# Altium schematic sheet Inputs.SchDoc: Controlo do Movimento de uma Claraboia
size A4; Author: André Moreira Oliveira; DocumentNumber: 1; Revision: 0.1; SheetNumber: 1; SheetTotal: 5; Number: 1181045
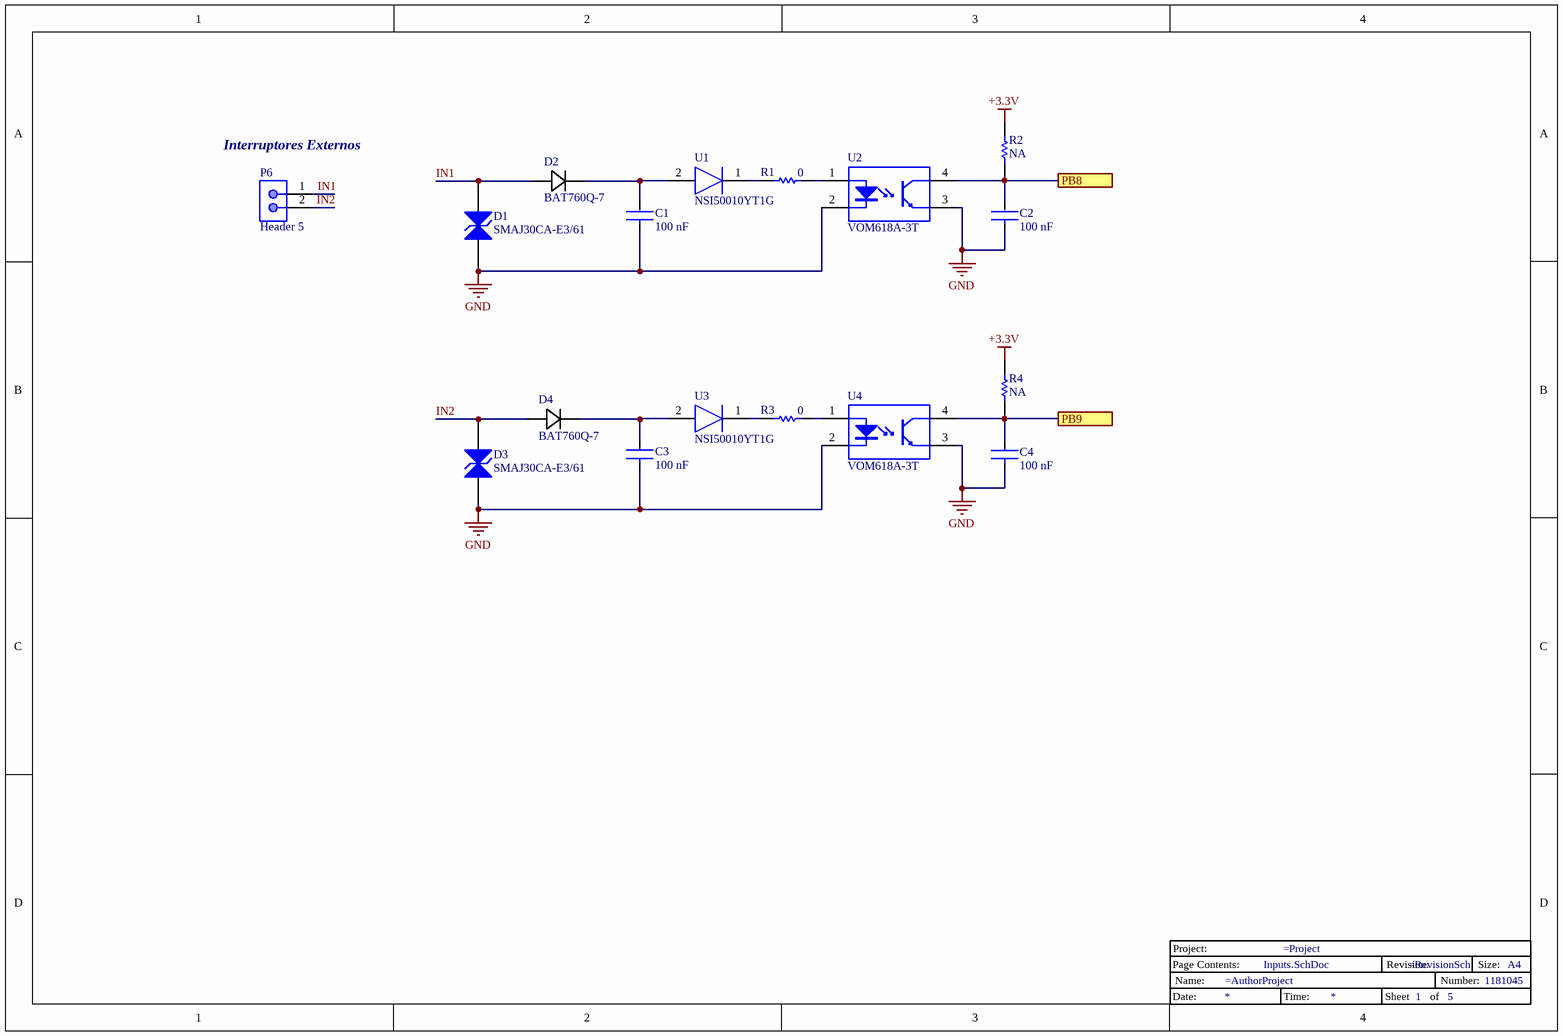
[diagram p0: Inputs.SchDoc]

## Parts
C1  100 nF  [FP-CC0603-DA-MFG]
C2  100 nF  [FP-CC0603-DA-MFG]
C3  100 nF  [FP-CC0603-DA-MFG]
C4  100 nF  [FP-CC0603-DA-MFG]
D1  SMAJ30CA-E3/61  [VISH-DO-214AC-2_L]
D2  BAT760Q-7  [DIODE_SOD-323_1P7X1P3_DIO-L]
D3  SMAJ30CA-E3/61  [VISH-DO-214AC-2_L]
D4  BAT760Q-7  [DIODE_SOD-323_1P7X1P3_DIO-L]
P6  Header 5  [MOLX-22-27-2021_V]
R1  0  [RESC1608X55X25ML10T15]
R2  NA  [RESC1608X55X25ML10T15]
R3  0  [RESC1608X55X25ML10T15]
R4  NA  [RESC1608X55X25ML10T15]
Title_Block_1  Title_Block  (value not drawn)
U1  NSI50010YT1G  [SOD3716X135N]
U2  VOM618A-3T  [VISH-SOP-4_V]
U3  NSI50010YT1G  [SOD3716X135N]
U4  VOM618A-3T  [VISH-SOP-4_V]

## Ports
PB8, PB9

## Nets
+3.3V: R2.2 R4.2
GND: C1.1 C2.1 C3.1 C4.1 D1.1(A1) D3.1(A1) U2.2(CATHODE) U2.3(EMITTER) U4.2(CATHODE) U4.3(EMITTER)
IN1: D1.2(A2) D2.2 P6.1
IN2: D3.2(A2) D4.2 P6.2
PB8: C2.2 R2.1 U2.4(COLLECTOR) ; port PB8
PB9: C4.2 R4.1 U4.4(COLLECTOR) ; port PB9
NetC1_2: C1.2 D2.1 U1.2(A)
NetC3_2: C3.2 D4.1 U3.2(A)
NetR1_1: R1.1 U1.1(K)
NetR1_2: R1.2 U2.1(ANODE)
NetR3_1: R3.1 U3.1(K)
NetR3_2: R3.2 U4.1(ANODE)

## Notes on the sheet
- (near P6) Interruptores Externos
- (in symbol Title_Block) Project:; Page Contents:; Revision:; Size:; A4; Name:; Number:; Date:; Time:; Sheet; of

## Library data of the parts
C1-C4 = CMP-2100-03601-2: CAP CER 0.1UF 50V X7R 0603; Manufacturer: YAGEO; Manufacturer Part Number: CC0603KRX7R9BB104; Material: Ceramic; Temperature Coefficient: 15%; Tolerance: 0.1; Height: 0.9mm; Voltage: 50 V; ComponentLink2Description: Datasheet; Device Class L2: Capacitors; Temperature Range High: +125°C; Category: Cap; Capacitance: 100 nF; Footprint Url: http://www.yageo.com/exep/pages/download/literatures/UPY-C_GEN_24.pdf; ComponentLink2URL: http://www.yageo.com/documents/recent/UPY-GPHC_X7R_6.3V-to-50V_18.pdf; Package: CC0603-DA; Temperature: -55°C to +125°C; Voltage Rating: 50 V; Temperature Characteristic: X7R; Device Class L1: Passive Components; Temperature Range Low: -55°C; RoHS: TRUE; Automotive: No; Value: 100 nF; Device Class L3: Ceramic Capacitors; Octopart: https://octopart.com/cc0603krx7r9bb104-yageo-42244635; Mouser Description: Multilayer Ceramic Capacitor, CC Series, 0.1 - F, - 10%, X7R, 50 V, 0603 [1608 Metric]; Lead Free: Yes; Digikey Description: CAP CER 0.1UF 50V X7R 0603
D1 D3 = CMP-0548-00185-2: Transient Voltage Suppressor, 6.40 to 231 V, 30 V Stand-off Voltage, Bi-Directional, -55 to 155 degC, 2-pin DO-214AC, Pb-Free, Tape and Reel; Manufacturer: Vishay Semiconductor; ID (uA): 2; IFSM: 40 A; PPPM (W): 400, 300; VWM (V): 30; VBR Bi-Directional (V): 6.4 to 231; PartNumber: SMAJ30CA-E3/61; Mounting Technology: Surface Mount; Operating Junction and Storage Temperature Range: -55 to 150 degC; ComponentLink1Description: Manufacturer URL; PackageReference: DO-214AC-2; ComponentLink3URL: http://www.vishay.com/docs/88390/smaj50a.pdf; ComponentLink2URL: http://www.vishay.com/docs/88390/smaj50a.pdf; RoHS: TRUE; DatasheetVersion: 12/8/2013; Packing: Tape and Reel; ComponentLink1URL: http://www.vishay.com/; ComponentLink2Description: Datasheet; ComponentLink3Description: Package Specification; PackageDescription: 2-Pin DO-214AC (SMA), Body 4.245 x 2.665 mm
D2 D4 = BAT760Q-7: No Description Available; Vendor: Diodes Inc; Built_By: EMA_Anthony; SourceLibrary: Diodes_Inc_2020-03-05; Type: DEV; Datasheet: https://media.digikey.com/pdf/Data%20Sheets/Diodes%20PDFs/BAT760.pdf; Copyright: Copyright (C) 2018 Accelerated Designs. All rights reserved; Manufacturer_Part_Number: BAT760Q-7; RefDes: RefDes
P6 = CMP-2000-05537-1: Male Header, Pitch 2.54 mm, 1 x 2 Position, Height 11.7 mm, Tail Length 3.56 mm, 0 to 75 degC, RoHS, Bulk; Manufacturer: Molex; PartNumber: 0022272021; Current rating: 4A; Package Version: Rev. BC, 02/2012; Voltage rating: 250V; No. of Positions: 2; Pitch: 2.54mm; No. of Rows: 1; Orientation: Vertical; Operating temperature: 0°Cto+75°C; Manufacturer URL: http://www.molex.com/; Mounting Technology: ThroughHole; Housing material: Nylon(UL94V-0); Package Description: 2-Leads Header, Body 5.08 x 5.8 mm, Pitch 2.54 mm; Voltage - Max: 250V; Datasheet URL: http://www.molex.com/pdm_docs/sd/022272021_sd.pdf; Package Reference: 22-27-2021; Contact material: Tinplatedbrass; Current - Max: 4A; Datasheet Version: Rev. F, 06/2009
R1-R4 = CMP-2100-03667-1: Chip Resistor, 0 Ohm, +/- 5%, 0.1 W, -55 to 155 degC, 0603 (1608 Metric), RoHS, Tape and Reel; Manufacturer: Yageo; Temperature Coefficient: 200ppm/degreesC; Voltage Rating: 50V; Power Rating: 100mW; Resistance: 0mOhm; Width: 0.8mm; Max Operating Temperature: 155degC; Tolerance: 5%; Package Reference: 0603; Height: 0.45mm; Depth: 0.8mm; Package Description: 2-Pin Surface Mount Device, Body 1.6 x 0.8 mm; Termination: SMD/SMT; Package Quantity: 5000; Case/Package: 0603; Case Code (Imperial): 0603; Radiation Hardening: No; Number of Pins: 2; Length: 1.6mm; Lead Free: LeadFree; Voltage Rating (DC): 50V; Military Standard: Not; Datasheet URL: http://www.yageo.com/NewPortal/yageodocoutput?fileName=/pdf/R-Chip/PYu-RC_Group_51_RoHS_L_5.pdf; Manufacturer URL: http://www.yageo.com/; Packaging: TapeandReel; Case Code (Metric): 1608; Min Operating Temperature: -55degC; Composition: ThickFilm; RoHSCompliant: true; Contact Plating: Tin; Datasheet Version: Rev. 5, 10/2016; REACH SVHC: NoSVHC
U1 U3 = NSI50010YT1G: Diode; Manufacturer_Name: ON Semiconductor; Datasheet Link: http://www.onsemi.com/pub/Collateral/NSI50010Y-D.PDF; Height: 1.35mm; Manufacturer_Part_Number: NSI50010YT1G; Mouser Part Number: 863-NSI50010YT1G; Mouser Price/Stock: https://www.mouser.co.uk/ProductDetail/ON-Semiconductor/NSI50010YT1G?qs=dubiLKbpNDpeXNVeIAV4bg%3D%3D; Arrow Part Number: NSI50010YT1G; Arrow Price/Stock: https://www.arrow.com/en/products/nsi50010yt1g/on-semiconductor
U2 U4 = CMP-2000-07401-1: Low Input Current, Phototransistor Output, 80 V, 170 mW, -55 to 110 degC, 4-Pin SOP, RoHS, Tape and Reel; Manufacturer: Vishay; Input Type: DC; Voltage - Isolation: 3750Vrms; Turn On / Turn Off Time (Typ): 7µs,6µs; Current Transfer Ratio (Min): 100%@1mA; Current - DC Forward (If) (Max): 60mA; Online Catalog: VOM617A,VOM618ASeries; Voltage - Output (Max): 80V; Voltage - Forward (Vf) (Typ): 1.1V; Current - Output / Channel: 50mA; Rise / Fall Time (Typ): 5µs,4µs; Other Names: VOM618A-3CT; Current Transfer Ratio (Max): 200%@1mA; Number of Channels: 1; Vce Saturation (Max): 400mV; Category: Isolators; Standard Package: 1; Mounting Type: SurfaceMount; Output Type: Transistor; Mounting Technology: SurfaceMount; Manufacturer URL: http://www.vishay.com/; Package Reference: SOP-4; Supplier Device Package: 4-SOP(2.54mm); Packaging: CutTape(CT); Family: Optoisolators-Transistor,PhotovoltaicOutput; Datasheet Version: Rev. 1.4, 10/2013; Package Description: 4-Pin Small Outline Package Integrated Circuit, Body 4.4 x 3.85 mm, Pitch 2.54 mm; Operating Temperature: -55°C~110°C; Series: -; Package / Case: 4-SMD,GullWing; Datasheet URL: http://download.siliconexpert.com/pdfs/2016/3/15/21/48/34/980/vsh_/manual/832624671428055vom618a.pdf